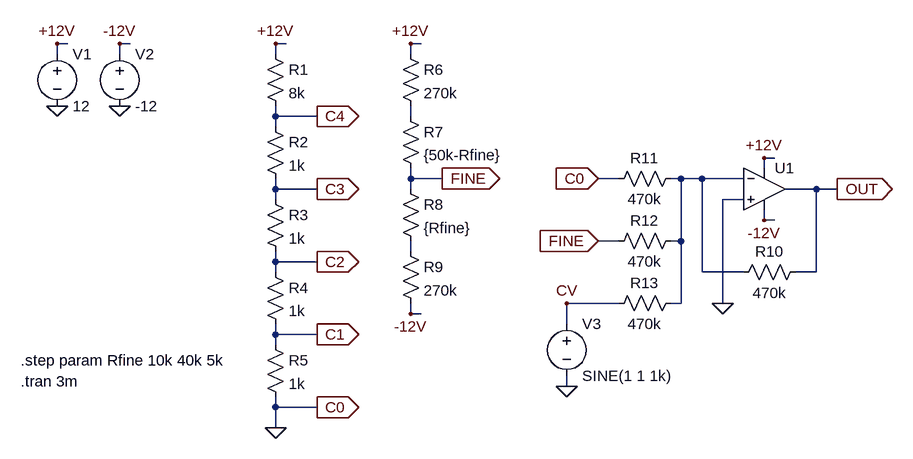
[diagram p0: schematic Antilog_NPNO_Courase_Test.asc]
Antilog_NPNO_Courase_Test.asc, the LTspice schematic file:
Version 4
SHEET 1 880 680
WIRE -832 0 -848 0
WIRE -736 0 -752 0
WIRE -496 0 -512 0
WIRE -288 0 -304 0
WIRE -848 16 -848 0
WIRE -752 16 -752 0
WIRE -512 16 -512 0
WIRE -304 16 -304 0
WIRE -512 112 -512 96
WIRE -448 112 -512 112
WIRE -304 112 -304 96
WIRE -512 128 -512 112
WIRE 256 176 240 176
WIRE 240 192 240 176
WIRE -304 208 -304 192
WIRE -256 208 -304 208
WIRE 16 208 -16 208
WIRE 112 208 96 208
WIRE 144 208 112 208
WIRE 208 208 144 208
WIRE -512 224 -512 208
WIRE -448 224 -512 224
WIRE -304 224 -304 208
WIRE 320 224 272 224
WIRE 352 224 320 224
WIRE -512 240 -512 224
WIRE 208 240 176 240
WIRE 240 272 240 256
WIRE 256 272 240 272
WIRE 16 304 -16 304
WIRE 112 304 112 208
WIRE 112 304 96 304
WIRE -304 320 -304 304
WIRE -512 336 -512 320
WIRE -448 336 -512 336
WIRE -512 352 -512 336
WIRE 144 352 144 208
WIRE 208 352 144 352
WIRE 320 352 320 224
WIRE 320 352 288 352
WIRE 16 400 -64 400
WIRE 112 400 112 304
WIRE 112 400 96 400
WIRE 176 400 176 240
WIRE -304 416 -304 400
WIRE -288 416 -304 416
WIRE -64 432 -64 400
WIRE -512 448 -512 432
WIRE -448 448 -512 448
WIRE -512 464 -512 448
WIRE -64 528 -64 512
WIRE -512 560 -512 544
WIRE -448 560 -512 560
WIRE -512 592 -512 560
FLAG -512 592 0
FLAG -512 0 +12V
FLAG -448 560 C0
IOPIN -448 560 Out
FLAG -448 448 C1
IOPIN -448 448 Out
FLAG -448 336 C2
IOPIN -448 336 Out
FLAG -448 224 C3
IOPIN -448 224 Out
FLAG -448 112 C4
IOPIN -448 112 Out
FLAG -848 96 0
FLAG -848 0 +12V
FLAG -304 0 +12V
FLAG -304 416 -12V
FLAG -256 208 FINE
IOPIN -256 208 Out
FLAG -752 96 0
FLAG -752 0 -12V
FLAG 240 176 +12V
FLAG 240 272 -12V
FLAG 176 400 0
FLAG 352 224 OUT
IOPIN 352 224 Out
FLAG -16 208 C0
IOPIN -16 208 In
FLAG -16 304 FINE
IOPIN -16 304 In
FLAG -64 528 0
FLAG -64 400 CV
SYMBOL res -528 0 R0
SYMATTR InstName R1
SYMATTR Value 8k
SYMBOL res -528 112 R0
SYMATTR InstName R2
SYMATTR Value 1k
SYMBOL res -528 224 R0
SYMATTR InstName R3
SYMATTR Value 1k
SYMBOL res -528 336 R0
SYMATTR InstName R4
SYMATTR Value 1k
SYMBOL res -528 448 R0
SYMATTR InstName R5
SYMATTR Value 1k
SYMBOL voltage -848 0 R0
WINDOW 123 0 0 Left 0
WINDOW 39 0 0 Left 0
SYMATTR InstName V1
SYMATTR Value 12
SYMBOL res -320 0 R0
SYMATTR InstName R6
SYMATTR Value 270k
SYMBOL res -320 96 R0
SYMATTR InstName R7
SYMATTR Value {50k-Rfine}
SYMBOL res -320 208 R0
SYMATTR InstName R8
SYMATTR Value {Rfine}
SYMBOL res -320 304 R0
SYMATTR InstName R9
SYMATTR Value 270k
SYMBOL voltage -752 0 R0
WINDOW 123 0 0 Left 0
WINDOW 39 0 0 Left 0
SYMATTR InstName V2
SYMATTR Value -12
SYMBOL Opamps\\UniversalOpamp2 240 224 R0
SYMATTR InstName U1
SYMBOL res 304 336 R90
WINDOW 0 0 56 VBottom 2
WINDOW 3 32 56 VTop 2
SYMATTR InstName R10
SYMATTR Value 470k
SYMBOL res 112 192 R90
WINDOW 0 0 56 VBottom 2
WINDOW 3 32 56 VTop 2
SYMATTR InstName R11
SYMATTR Value 470k
SYMBOL res 112 288 R90
WINDOW 0 0 56 VBottom 2
WINDOW 3 32 56 VTop 2
SYMATTR InstName R12
SYMATTR Value 470k
SYMBOL res 112 384 R90
WINDOW 0 0 56 VBottom 2
WINDOW 3 32 56 VTop 2
SYMATTR InstName R13
SYMATTR Value 470k
SYMBOL voltage -64 416 R0
WINDOW 123 0 0 Left 0
WINDOW 39 0 0 Left 0
SYMATTR InstName V3
SYMATTR Value SINE(1 1 1k)
TEXT -904 488 Left 2 !.step param Rfine 10k 40k 5k
TEXT -904 520 Left 2 !.tran 3m

The netlist it stands for:
* Antilog_NPNO_Courase_Test.asc
R1 +12V C4 8k
R2 C4 C3 1k
R3 C3 C2 1k
R4 C2 C1 1k
R5 C1 0 1k
V1 +12V 0 12
R6 +12V N001 270k
R7 N001 FINE {50k-Rfine}
R8 FINE N003 {Rfine}
R9 N003 -12V 270k
V2 -12V 0 -12
XU1 0 N002 +12V -12V OUT level.2 Avol=1Meg GBW=10Meg Slew=10Meg ilimit=25m rail=0 Vos=0 phimargin=45 en=0 enk=0 in=0 ink=0 Rin=500Meg  ; pins IN+ IN- V+ V- OUT
R10 OUT N002 470k
R11 N002 0 470k
R12 N002 FINE 470k
R13 N002 CV 470k
V3 CV 0 SINE(1 1 1k)
.step param Rfine 10k 40k 5k
.tran 3m
.lib UniversalOpamps2.sub
.backanno
.end